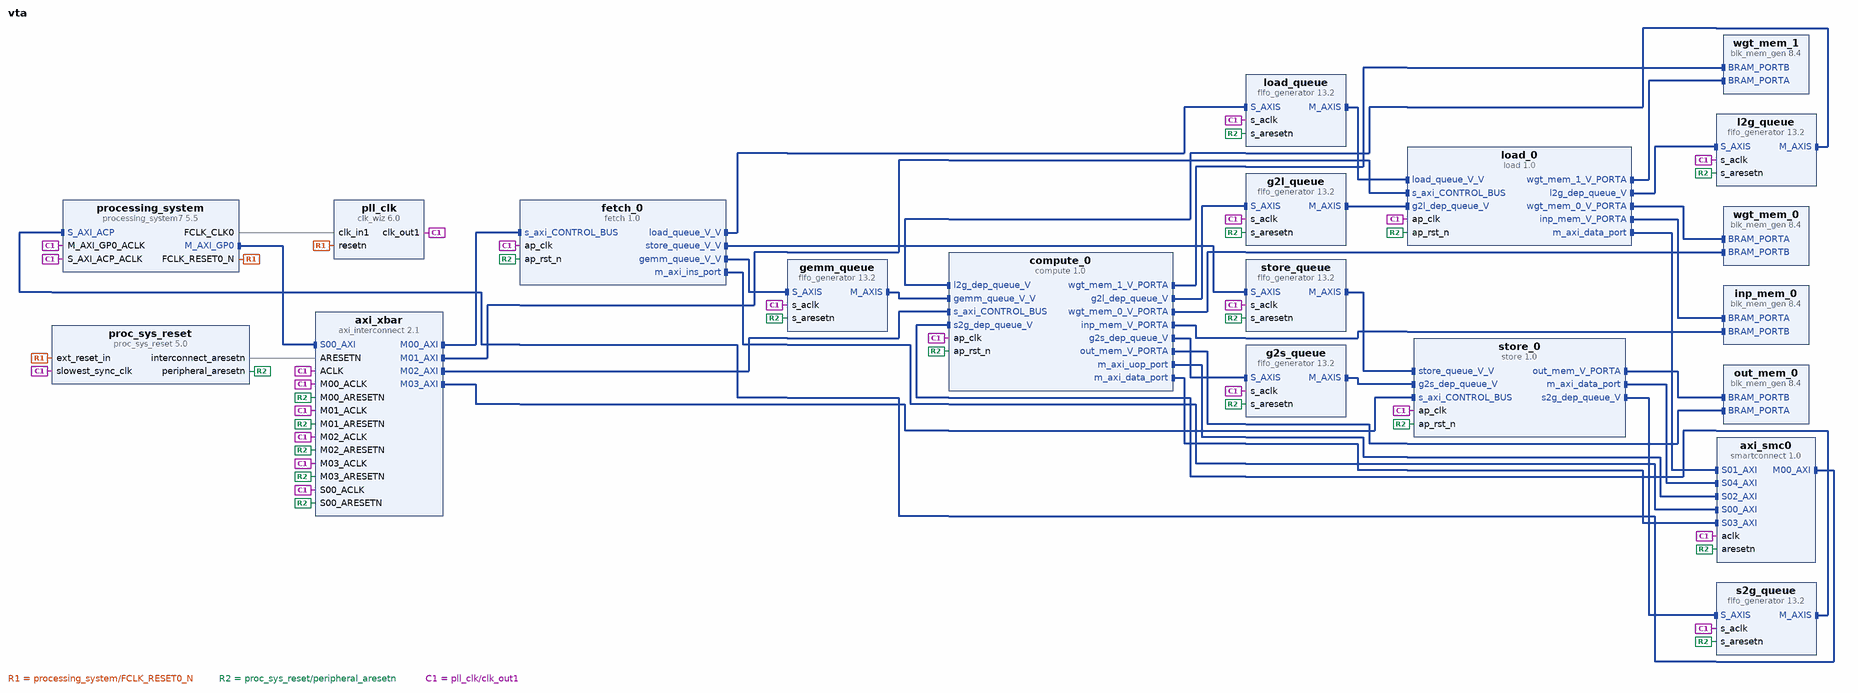
[diagram p0: block diagram of the top level]
# Vivado block design vta, xc7z020clg484-1, Vivado 2020.1
create_bd_design vta

create_bd_cell -type ip -vlnv xilinx.com:ip:proc_sys_reset:5.0 proc_sys_reset
create_bd_cell -type ip -vlnv xilinx.com:ip:clk_wiz:6.0 pll_clk
set_property -dict [list \
  CONFIG.CLKOUT1_REQUESTED_OUT_FREQ 100 \
  CONFIG.RESET_PORT resetn \
  CONFIG.RESET_TYPE ACTIVE_LOW \
  CONFIG.USE_LOCKED false \
] [get_bd_cells pll_clk]
create_bd_cell -type ip -vlnv xilinx.com:ip:smartconnect:1.0 axi_smc0
set_property -dict {CONFIG.NUM_MI 1 CONFIG.NUM_SI 5} [get_bd_cells axi_smc0]
create_bd_cell -type ip -vlnv xilinx.com:ip:axi_interconnect:2.1 axi_xbar
set_property -dict {CONFIG.NUM_MI 4 CONFIG.NUM_SI 1} [get_bd_cells axi_xbar]
create_bd_cell -type ip -vlnv xilinx.com:hls:fetch:1.0 fetch_0
set_property -dict {CONFIG.C_M_AXI_INS_PORT_CACHE_VALUE 1111 CONFIG.C_M_AXI_INS_PORT_PROT_VALUE 000} [get_bd_cells fetch_0]
create_bd_cell -type ip -vlnv xilinx.com:hls:load:1.0 load_0
set_property -dict {CONFIG.C_M_AXI_DATA_PORT_CACHE_VALUE 1111 CONFIG.C_M_AXI_DATA_PORT_PROT_VALUE 000} [get_bd_cells load_0]
create_bd_cell -type ip -vlnv xilinx.com:hls:compute:1.0 compute_0
set_property -dict [list \
  CONFIG.C_M_AXI_DATA_PORT_CACHE_VALUE 1111 \
  CONFIG.C_M_AXI_DATA_PORT_PROT_VALUE 000 \
  CONFIG.C_M_AXI_UOP_PORT_CACHE_VALUE 1111 \
  CONFIG.C_M_AXI_UOP_PORT_PROT_VALUE 000 \
] [get_bd_cells compute_0]
create_bd_cell -type ip -vlnv xilinx.com:hls:store:1.0 store_0
set_property -dict {CONFIG.C_M_AXI_DATA_PORT_CACHE_VALUE 1111 CONFIG.C_M_AXI_DATA_PORT_PROT_VALUE 000} [get_bd_cells store_0]
create_bd_cell -type ip -vlnv xilinx.com:ip:fifo_generator:13.2 load_queue
set_property -dict [list \
  CONFIG.FIFO_Implementation_rach Common_Clock_Distributed_RAM \
  CONFIG.FIFO_Implementation_wach Common_Clock_Distributed_RAM \
  CONFIG.FIFO_Implementation_wrch Common_Clock_Distributed_RAM \
  CONFIG.Full_Flags_Reset_Value 1 \
  CONFIG.INTERFACE_TYPE AXI_STREAM \
  CONFIG.Input_Depth_axis 512 \
  CONFIG.TDATA_NUM_BYTES 16 \
] [get_bd_cells load_queue]
create_bd_cell -type ip -vlnv xilinx.com:ip:fifo_generator:13.2 gemm_queue
set_property -dict [list \
  CONFIG.FIFO_Implementation_rach Common_Clock_Distributed_RAM \
  CONFIG.FIFO_Implementation_wach Common_Clock_Distributed_RAM \
  CONFIG.FIFO_Implementation_wrch Common_Clock_Distributed_RAM \
  CONFIG.Full_Flags_Reset_Value 1 \
  CONFIG.INTERFACE_TYPE AXI_STREAM \
  CONFIG.Input_Depth_axis 512 \
  CONFIG.TDATA_NUM_BYTES 16 \
] [get_bd_cells gemm_queue]
create_bd_cell -type ip -vlnv xilinx.com:ip:fifo_generator:13.2 store_queue
set_property -dict [list \
  CONFIG.FIFO_Implementation_rach Common_Clock_Distributed_RAM \
  CONFIG.FIFO_Implementation_wach Common_Clock_Distributed_RAM \
  CONFIG.FIFO_Implementation_wrch Common_Clock_Distributed_RAM \
  CONFIG.Full_Flags_Reset_Value 1 \
  CONFIG.INTERFACE_TYPE AXI_STREAM \
  CONFIG.Input_Depth_axis 512 \
  CONFIG.TDATA_NUM_BYTES 16 \
] [get_bd_cells store_queue]
create_bd_cell -type ip -vlnv xilinx.com:ip:fifo_generator:13.2 l2g_queue
set_property -dict [list \
  CONFIG.FIFO_Implementation_rach Common_Clock_Distributed_RAM \
  CONFIG.FIFO_Implementation_wach Common_Clock_Distributed_RAM \
  CONFIG.FIFO_Implementation_wrch Common_Clock_Distributed_RAM \
  CONFIG.Full_Flags_Reset_Value 1 \
  CONFIG.INTERFACE_TYPE AXI_STREAM \
  CONFIG.Input_Depth_axis 1024 \
  CONFIG.TDATA_NUM_BYTES 1 \
] [get_bd_cells l2g_queue]
create_bd_cell -type ip -vlnv xilinx.com:ip:fifo_generator:13.2 g2l_queue
set_property -dict [list \
  CONFIG.FIFO_Implementation_rach Common_Clock_Distributed_RAM \
  CONFIG.FIFO_Implementation_wach Common_Clock_Distributed_RAM \
  CONFIG.FIFO_Implementation_wrch Common_Clock_Distributed_RAM \
  CONFIG.Full_Flags_Reset_Value 1 \
  CONFIG.INTERFACE_TYPE AXI_STREAM \
  CONFIG.Input_Depth_axis 1024 \
  CONFIG.TDATA_NUM_BYTES 1 \
] [get_bd_cells g2l_queue]
create_bd_cell -type ip -vlnv xilinx.com:ip:fifo_generator:13.2 g2s_queue
set_property -dict [list \
  CONFIG.FIFO_Implementation_rach Common_Clock_Distributed_RAM \
  CONFIG.FIFO_Implementation_wach Common_Clock_Distributed_RAM \
  CONFIG.FIFO_Implementation_wrch Common_Clock_Distributed_RAM \
  CONFIG.Full_Flags_Reset_Value 1 \
  CONFIG.INTERFACE_TYPE AXI_STREAM \
  CONFIG.Input_Depth_axis 1024 \
  CONFIG.TDATA_NUM_BYTES 1 \
] [get_bd_cells g2s_queue]
create_bd_cell -type ip -vlnv xilinx.com:ip:fifo_generator:13.2 s2g_queue
set_property -dict [list \
  CONFIG.FIFO_Implementation_rach Common_Clock_Distributed_RAM \
  CONFIG.FIFO_Implementation_wach Common_Clock_Distributed_RAM \
  CONFIG.FIFO_Implementation_wrch Common_Clock_Distributed_RAM \
  CONFIG.Full_Flags_Reset_Value 1 \
  CONFIG.INTERFACE_TYPE AXI_STREAM \
  CONFIG.Input_Depth_axis 1024 \
  CONFIG.TDATA_NUM_BYTES 1 \
] [get_bd_cells s2g_queue]
create_bd_cell -type ip -vlnv xilinx.com:ip:blk_mem_gen:8.4 inp_mem_0
set_property -dict [list \
  CONFIG.Assume_Synchronous_Clk true \
  CONFIG.Enable_32bit_Address true \
  CONFIG.Enable_B Use_ENB_Pin \
  CONFIG.Memory_Type True_Dual_Port_RAM \
  CONFIG.Read_Width_A 128 \
  CONFIG.Read_Width_B 128 \
  CONFIG.Register_PortA_Output_of_Memory_Primitives false \
  CONFIG.Register_PortB_Output_of_Memory_Primitives false \
  CONFIG.Use_RSTA_Pin true \
  CONFIG.Use_RSTB_Pin true \
  CONFIG.Write_Depth_A 2048 \
  CONFIG.Write_Width_A 128 \
  CONFIG.Write_Width_B 128 \
  CONFIG.use_bram_block Stand_Alone \
] [get_bd_cells inp_mem_0]
create_bd_cell -type ip -vlnv xilinx.com:ip:blk_mem_gen:8.4 wgt_mem_0
set_property -dict [list \
  CONFIG.Assume_Synchronous_Clk true \
  CONFIG.Enable_32bit_Address true \
  CONFIG.Enable_B Use_ENB_Pin \
  CONFIG.Memory_Type True_Dual_Port_RAM \
  CONFIG.Read_Width_A 1024 \
  CONFIG.Read_Width_B 1024 \
  CONFIG.Register_PortA_Output_of_Memory_Primitives false \
  CONFIG.Register_PortB_Output_of_Memory_Primitives false \
  CONFIG.Use_RSTA_Pin true \
  CONFIG.Use_RSTB_Pin true \
  CONFIG.Write_Depth_A 1024 \
  CONFIG.Write_Width_A 1024 \
  CONFIG.Write_Width_B 1024 \
  CONFIG.use_bram_block Stand_Alone \
] [get_bd_cells wgt_mem_0]
create_bd_cell -type ip -vlnv xilinx.com:ip:blk_mem_gen:8.4 wgt_mem_1
set_property -dict [list \
  CONFIG.Assume_Synchronous_Clk true \
  CONFIG.Enable_32bit_Address true \
  CONFIG.Enable_B Use_ENB_Pin \
  CONFIG.Memory_Type True_Dual_Port_RAM \
  CONFIG.Read_Width_A 1024 \
  CONFIG.Read_Width_B 1024 \
  CONFIG.Register_PortA_Output_of_Memory_Primitives false \
  CONFIG.Register_PortB_Output_of_Memory_Primitives false \
  CONFIG.Use_RSTA_Pin true \
  CONFIG.Use_RSTB_Pin true \
  CONFIG.Write_Depth_A 1024 \
  CONFIG.Write_Width_A 1024 \
  CONFIG.Write_Width_B 1024 \
  CONFIG.use_bram_block Stand_Alone \
] [get_bd_cells wgt_mem_1]
create_bd_cell -type ip -vlnv xilinx.com:ip:blk_mem_gen:8.4 out_mem_0
set_property -dict [list \
  CONFIG.Assume_Synchronous_Clk true \
  CONFIG.Enable_32bit_Address true \
  CONFIG.Enable_B Use_ENB_Pin \
  CONFIG.Memory_Type True_Dual_Port_RAM \
  CONFIG.Read_Width_A 128 \
  CONFIG.Read_Width_B 128 \
  CONFIG.Register_PortA_Output_of_Memory_Primitives false \
  CONFIG.Register_PortB_Output_of_Memory_Primitives false \
  CONFIG.Use_RSTA_Pin true \
  CONFIG.Use_RSTB_Pin true \
  CONFIG.Write_Depth_A 2048 \
  CONFIG.Write_Width_A 128 \
  CONFIG.Write_Width_B 128 \
  CONFIG.use_bram_block Stand_Alone \
] [get_bd_cells out_mem_0]
create_bd_cell -type ip -vlnv xilinx.com:ip:processing_system7:5.5 processing_system
set_property -dict [list \
  CONFIG.PCW_APU_PERIPHERAL_FREQMHZ 666.666666 \
  CONFIG.PCW_CAN0_CAN0_IO {MIO 46 .. 47} \
  CONFIG.PCW_CAN0_PERIPHERAL_ENABLE 1 \
  CONFIG.PCW_CAN_PERIPHERAL_FREQMHZ 23.8095 \
  CONFIG.PCW_ENET0_ENET0_IO {MIO 16 .. 27} \
  CONFIG.PCW_ENET0_GRP_MDIO_ENABLE 1 \
  CONFIG.PCW_ENET0_GRP_MDIO_IO {MIO 52 .. 53} \
  CONFIG.PCW_ENET0_PERIPHERAL_ENABLE 1 \
  CONFIG.PCW_ENET0_PERIPHERAL_FREQMHZ {100 Mbps} \
  CONFIG.PCW_ENET0_RESET_ENABLE 1 \
  CONFIG.PCW_ENET0_RESET_IO {MIO 11} \
  CONFIG.PCW_ENET_RESET_ENABLE 1 \
  CONFIG.PCW_ENET_RESET_SELECT {Share reset pin} \
  CONFIG.PCW_FPGA0_PERIPHERAL_FREQMHZ 100 \
  CONFIG.PCW_GPIO_MIO_GPIO_ENABLE 1 \
  CONFIG.PCW_GPIO_MIO_GPIO_IO MIO \
  CONFIG.PCW_I2C0_GRP_INT_ENABLE 0 \
  CONFIG.PCW_I2C0_I2C0_IO {MIO 50 .. 51} \
  CONFIG.PCW_I2C0_PERIPHERAL_ENABLE 1 \
  CONFIG.PCW_I2C0_RESET_ENABLE 1 \
  CONFIG.PCW_I2C0_RESET_IO {MIO 13} \
  CONFIG.PCW_I2C_PERIPHERAL_FREQMHZ 111.111115 \
  CONFIG.PCW_I2C_RESET_ENABLE 1 \
  CONFIG.PCW_I2C_RESET_SELECT {Share reset pin} \
  CONFIG.PCW_PRESET_BANK0_VOLTAGE {LVCMOS 1.8V} \
  CONFIG.PCW_PRESET_BANK1_VOLTAGE {LVCMOS 1.8V} \
  CONFIG.PCW_QSPI_GRP_FBCLK_ENABLE 1 \
  CONFIG.PCW_QSPI_GRP_FBCLK_IO {MIO 8} \
  CONFIG.PCW_QSPI_GRP_SINGLE_SS_ENABLE 1 \
  CONFIG.PCW_QSPI_GRP_SINGLE_SS_IO {MIO 1 .. 6} \
  CONFIG.PCW_QSPI_PERIPHERAL_ENABLE 1 \
  CONFIG.PCW_QSPI_QSPI_IO {MIO 1 .. 6} \
  CONFIG.PCW_SD0_GRP_CD_ENABLE 1 \
  CONFIG.PCW_SD0_GRP_CD_IO {MIO 0} \
  CONFIG.PCW_SD0_GRP_WP_ENABLE 1 \
  CONFIG.PCW_SD0_GRP_WP_IO {MIO 15} \
  CONFIG.PCW_SD0_PERIPHERAL_ENABLE 1 \
  CONFIG.PCW_SD0_SD0_IO {MIO 40 .. 45} \
  CONFIG.PCW_SDIO_PERIPHERAL_FREQMHZ 50 \
  CONFIG.PCW_SINGLE_QSPI_DATA_MODE x4 \
  CONFIG.PCW_TTC0_PERIPHERAL_ENABLE 1 \
  CONFIG.PCW_TTC0_TTC0_IO EMIO \
  CONFIG.PCW_UART1_PERIPHERAL_ENABLE 1 \
  CONFIG.PCW_UART1_UART1_IO {MIO 48 .. 49} \
  CONFIG.PCW_UART_PERIPHERAL_FREQMHZ 50 \
  CONFIG.PCW_UIPARAM_DDR_FREQ_MHZ 533.333333 \
  CONFIG.PCW_UIPARAM_DDR_PARTNO {MT41J256M8 HX-15E} \
  CONFIG.PCW_USB0_PERIPHERAL_ENABLE 1 \
  CONFIG.PCW_USB0_RESET_ENABLE 1 \
  CONFIG.PCW_USB0_RESET_IO {MIO 7} \
  CONFIG.PCW_USB0_USB0_IO {MIO 28 .. 39} \
  CONFIG.PCW_USB_RESET_ENABLE 1 \
  CONFIG.PCW_USB_RESET_SELECT {Share reset pin} \
  CONFIG.PCW_USE_DEFAULT_ACP_USER_VAL 1 \
  CONFIG.PCW_USE_S_AXI_ACP 1 \
  CONFIG.preset ZC702 \
] [get_bd_cells processing_system]
# 224 more settings of processing_system are not shown: defaults, MIO pin electricals, DDR timing, and values the tool derives

# ---- connections ----

connect_bd_intf_net [get_bd_intf_pins wgt_mem_0/BRAM_PORTA] [get_bd_intf_pins load_0/wgt_mem_0_V_PORTA]
connect_bd_intf_net [get_bd_intf_pins compute_0/g2l_dep_queue_V] [get_bd_intf_pins g2l_queue/S_AXIS]
connect_bd_intf_net [get_bd_intf_pins inp_mem_0/BRAM_PORTA] [get_bd_intf_pins load_0/inp_mem_V_PORTA]
connect_bd_intf_net [get_bd_intf_pins inp_mem_0/BRAM_PORTB] [get_bd_intf_pins compute_0/inp_mem_V_PORTA]
connect_bd_intf_net [get_bd_intf_pins wgt_mem_0/BRAM_PORTB] [get_bd_intf_pins compute_0/wgt_mem_0_V_PORTA]
connect_bd_intf_net [get_bd_intf_pins wgt_mem_1/BRAM_PORTA] [get_bd_intf_pins load_0/wgt_mem_1_V_PORTA]
connect_bd_intf_net [get_bd_intf_pins wgt_mem_1/BRAM_PORTB] [get_bd_intf_pins compute_0/wgt_mem_1_V_PORTA]
connect_bd_intf_net -intf_net compute_0_out_mem_0_V_PORTA [get_bd_intf_pins out_mem_0/BRAM_PORTA] [get_bd_intf_pins compute_0/out_mem_V_PORTA]
connect_bd_intf_net -intf_net store_0_out_mem_0_V_PORTA [get_bd_intf_pins out_mem_0/BRAM_PORTB] [get_bd_intf_pins store_0/out_mem_V_PORTA]
connect_bd_intf_net [get_bd_intf_pins axi_xbar/M00_AXI] [get_bd_intf_pins fetch_0/s_axi_CONTROL_BUS]
connect_bd_intf_net [get_bd_intf_pins axi_smc0/S01_AXI] [get_bd_intf_pins load_0/m_axi_data_port]
connect_bd_intf_net [get_bd_intf_pins axi_xbar/M02_AXI] [get_bd_intf_pins compute_0/s_axi_CONTROL_BUS]
connect_bd_intf_net [get_bd_intf_pins compute_0/s2g_dep_queue_V] [get_bd_intf_pins s2g_queue/M_AXIS]
connect_bd_intf_net [get_bd_intf_pins g2s_queue/M_AXIS] [get_bd_intf_pins store_0/g2s_dep_queue_V]
connect_bd_intf_net [get_bd_intf_pins axi_smc0/S00_AXI] [get_bd_intf_pins fetch_0/m_axi_ins_port]
connect_bd_intf_net [get_bd_intf_pins axi_xbar/M03_AXI] [get_bd_intf_pins store_0/s_axi_CONTROL_BUS]
connect_bd_intf_net [get_bd_intf_pins load_0/load_queue_V_V] [get_bd_intf_pins load_queue/M_AXIS]
connect_bd_intf_net [get_bd_intf_pins store_0/store_queue_V_V] [get_bd_intf_pins store_queue/M_AXIS]
connect_bd_intf_net [get_bd_intf_pins axi_smc0/M00_AXI] [get_bd_intf_pins processing_system/S_AXI_ACP]
connect_bd_intf_net [get_bd_intf_pins g2l_queue/M_AXIS] [get_bd_intf_pins load_0/g2l_dep_queue_V]
connect_bd_intf_net -intf_net processing_system_m_axi [get_bd_intf_pins axi_xbar/S00_AXI] [get_bd_intf_pins processing_system/M_AXI_GP0]
connect_bd_intf_net [get_bd_intf_pins axi_smc0/S02_AXI] [get_bd_intf_pins compute_0/m_axi_uop_port]
connect_bd_intf_net [get_bd_intf_pins fetch_0/gemm_queue_V_V] [get_bd_intf_pins gemm_queue/S_AXIS]
connect_bd_intf_net [get_bd_intf_pins fetch_0/store_queue_V_V] [get_bd_intf_pins store_queue/S_AXIS]
connect_bd_intf_net [get_bd_intf_pins compute_0/g2s_dep_queue_V] [get_bd_intf_pins g2s_queue/S_AXIS]
connect_bd_intf_net [get_bd_intf_pins axi_smc0/S04_AXI] [get_bd_intf_pins store_0/m_axi_data_port]
connect_bd_intf_net [get_bd_intf_pins axi_smc0/S03_AXI] [get_bd_intf_pins compute_0/m_axi_data_port]
connect_bd_intf_net [get_bd_intf_pins axi_xbar/M01_AXI] [get_bd_intf_pins load_0/s_axi_CONTROL_BUS]
connect_bd_intf_net [get_bd_intf_pins s2g_queue/S_AXIS] [get_bd_intf_pins store_0/s2g_dep_queue_V]
connect_bd_intf_net [get_bd_intf_pins compute_0/l2g_dep_queue_V] [get_bd_intf_pins l2g_queue/M_AXIS]
connect_bd_intf_net [get_bd_intf_pins compute_0/gemm_queue_V_V] [get_bd_intf_pins gemm_queue/M_AXIS]
connect_bd_intf_net -intf_net fetch_0_l2g_dep_queue_V [get_bd_intf_pins l2g_queue/S_AXIS] [get_bd_intf_pins load_0/l2g_dep_queue_V]
connect_bd_intf_net [get_bd_intf_pins fetch_0/load_queue_V_V] [get_bd_intf_pins load_queue/S_AXIS]
connect_bd_net -net processing_system_reset [get_bd_pins processing_system/FCLK_RESET0_N] \
  [get_bd_pins pll_clk/resetn] [get_bd_pins proc_sys_reset/ext_reset_in]
connect_bd_net -net ps_clk_net [get_bd_pins processing_system/FCLK_CLK0] [get_bd_pins pll_clk/clk_in1]
connect_bd_net [get_bd_pins proc_sys_reset/interconnect_aresetn] [get_bd_pins axi_xbar/ARESETN]
connect_bd_net [get_bd_pins proc_sys_reset/peripheral_aresetn] \
  [get_bd_pins axi_smc0/aresetn] [get_bd_pins axi_xbar/M00_ARESETN] [get_bd_pins axi_xbar/M01_ARESETN] \
  [get_bd_pins axi_xbar/M02_ARESETN] [get_bd_pins axi_xbar/M03_ARESETN] [get_bd_pins axi_xbar/S00_ARESETN] \
  [get_bd_pins fetch_0/ap_rst_n] [get_bd_pins load_0/ap_rst_n] [get_bd_pins store_0/ap_rst_n] \
  [get_bd_pins compute_0/ap_rst_n] [get_bd_pins load_queue/s_aresetn] [get_bd_pins gemm_queue/s_aresetn] \
  [get_bd_pins store_queue/s_aresetn] [get_bd_pins l2g_queue/s_aresetn] [get_bd_pins g2l_queue/s_aresetn] \
  [get_bd_pins g2s_queue/s_aresetn] [get_bd_pins s2g_queue/s_aresetn]
connect_bd_net -net processing_system_clk [get_bd_pins pll_clk/clk_out1] \
  [get_bd_pins proc_sys_reset/slowest_sync_clk] [get_bd_pins axi_smc0/aclk] [get_bd_pins axi_xbar/ACLK] \
  [get_bd_pins axi_xbar/M00_ACLK] [get_bd_pins axi_xbar/M01_ACLK] [get_bd_pins axi_xbar/M02_ACLK] \
  [get_bd_pins axi_xbar/M03_ACLK] [get_bd_pins axi_xbar/S00_ACLK] [get_bd_pins fetch_0/ap_clk] [get_bd_pins load_0/ap_clk] \
  [get_bd_pins compute_0/ap_clk] [get_bd_pins store_0/ap_clk] [get_bd_pins load_queue/s_aclk] [get_bd_pins gemm_queue/s_aclk] \
  [get_bd_pins store_queue/s_aclk] [get_bd_pins l2g_queue/s_aclk] [get_bd_pins g2l_queue/s_aclk] \
  [get_bd_pins g2s_queue/s_aclk] [get_bd_pins s2g_queue/s_aclk] [get_bd_pins processing_system/M_AXI_GP0_ACLK] \
  [get_bd_pins processing_system/S_AXI_ACP_ACLK]

# ---- address map ----
assign_bd_address -offset 0x00000000 -range 1G -target_address_space [get_bd_addr_spaces compute_0/Data_m_axi_data_port] [get_bd_addr_segs processing_system/S_AXI_ACP/ACP_DDR_LOWOCM]
assign_bd_address -offset 0x00000000 -range 1G -target_address_space [get_bd_addr_spaces compute_0/Data_m_axi_uop_port] [get_bd_addr_segs processing_system/S_AXI_ACP/ACP_DDR_LOWOCM]
assign_bd_address -offset 0x00000000 -range 1G -target_address_space [get_bd_addr_spaces fetch_0/Data_m_axi_ins_port] [get_bd_addr_segs processing_system/S_AXI_ACP/ACP_DDR_LOWOCM]
assign_bd_address -offset 0x00000000 -range 1G -target_address_space [get_bd_addr_spaces load_0/Data_m_axi_data_port] [get_bd_addr_segs processing_system/S_AXI_ACP/ACP_DDR_LOWOCM]
assign_bd_address -offset 0x43C00000 -range 4K -target_address_space [get_bd_addr_spaces processing_system/Data] [get_bd_addr_segs fetch_0/s_axi_CONTROL_BUS/Reg]
assign_bd_address -offset 0x43C01000 -range 4K -target_address_space [get_bd_addr_spaces processing_system/Data] [get_bd_addr_segs load_0/s_axi_CONTROL_BUS/Reg]
assign_bd_address -offset 0x43C02000 -range 4K -target_address_space [get_bd_addr_spaces processing_system/Data] [get_bd_addr_segs compute_0/s_axi_CONTROL_BUS/Reg]
assign_bd_address -offset 0x43C03000 -range 4K -target_address_space [get_bd_addr_spaces processing_system/Data] [get_bd_addr_segs store_0/s_axi_CONTROL_BUS/Reg]
assign_bd_address -offset 0x00000000 -range 1G -target_address_space [get_bd_addr_spaces store_0/Data_m_axi_data_port] [get_bd_addr_segs processing_system/S_AXI_ACP/ACP_DDR_LOWOCM]

validate_bd_design
save_bd_design
